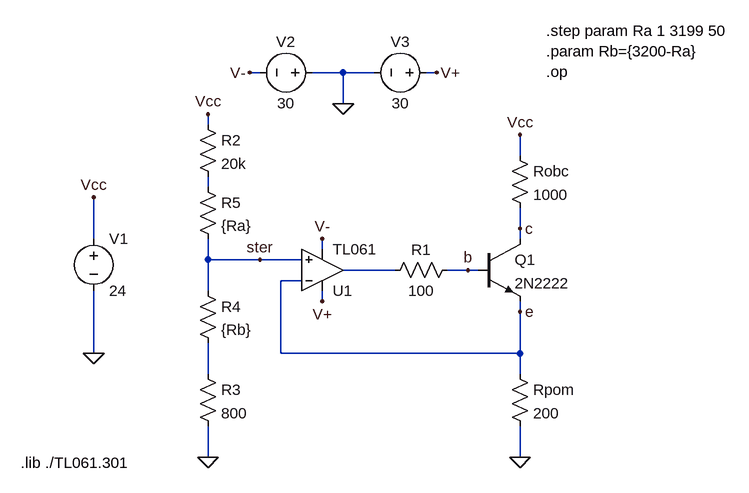
[diagram p0: schematic NPN.asc]
NPN.asc, the LTspice schematic file:
Version 4
SHEET 1 1228 680
WIRE 384 -272 368 -272
WIRE 512 -272 464 -272
WIRE 560 -272 512 -272
WIRE 656 -272 640 -272
WIRE 512 -224 512 -272
WIRE 304 -192 304 -208
WIRE 784 -144 784 -176
WIRE 304 -96 304 -112
WIRE 784 -32 784 -64
WIRE 128 -16 128 -80
WIRE 784 -16 784 -32
WIRE 480 0 480 -16
WIRE 304 16 304 -16
WIRE 384 16 304 16
WIRE 448 16 384 16
WIRE 592 32 512 32
WIRE 704 32 672 32
WIRE 720 32 704 32
WIRE 448 48 416 48
WIRE 304 64 304 16
WIRE 480 80 480 64
WIRE 784 96 784 80
WIRE 128 160 128 64
WIRE 416 160 416 48
WIRE 784 160 784 96
WIRE 784 160 416 160
WIRE 304 192 304 144
WIRE 784 192 784 160
WIRE 304 320 304 272
WIRE 784 320 784 272
FLAG 128 -80 Vcc
FLAG 128 160 0
FLAG 512 -224 0
FLAG 656 -272 V+
FLAG 368 -272 V-
FLAG 480 -16 V-
FLAG 480 80 V+
FLAG 784 -176 Vcc
FLAG 784 320 0
FLAG 784 96 e
FLAG 784 -32 c
FLAG 704 32 b
FLAG 304 320 0
FLAG 304 -208 Vcc
FLAG 384 16 ster
SYMBOL npn 720 -16 R0
SYMATTR InstName Q1
SYMATTR Value 2N2222
SYMBOL OpAmps\\opamp2 480 96 M180
SYMATTR InstName U1
SYMATTR Value TL061
SYMBOL voltage 128 -32 R0
WINDOW 123 0 0 Left 0
WINDOW 39 0 0 Left 0
SYMATTR InstName V1
SYMATTR Value 24
SYMBOL voltage 480 -272 R90
WINDOW 0 -32 56 VBottom 2
WINDOW 3 32 56 VTop 2
WINDOW 123 0 0 Left 0
WINDOW 39 0 0 Left 0
SYMATTR InstName V2
SYMATTR Value 30
SYMBOL voltage 656 -272 R90
WINDOW 0 -32 56 VBottom 2
WINDOW 3 32 56 VTop 2
WINDOW 123 0 0 Left 0
WINDOW 39 0 0 Left 0
SYMATTR InstName V3
SYMATTR Value 30
SYMBOL res 768 -160 R0
SYMATTR InstName Robc
SYMATTR Value 1000
SYMBOL res 768 176 R0
SYMATTR InstName Rpom
SYMATTR Value 200
SYMBOL res 688 16 R90
WINDOW 0 0 56 VBottom 2
WINDOW 3 32 56 VTop 2
SYMATTR InstName R1
SYMATTR Value 100
SYMBOL res 288 -208 R0
SYMATTR InstName R2
SYMATTR Value 20k
SYMBOL res 288 176 R0
SYMATTR InstName R3
SYMATTR Value 800
SYMBOL res 288 48 R0
SYMATTR InstName R4
SYMATTR Value {Rb}
SYMBOL res 288 -112 R0
SYMATTR InstName R5
SYMATTR Value {Ra}
TEXT 16 328 Left 2 !.lib ./TL061.301
TEXT 824 -336 Left 2 !.step param Ra 1 3199 50\n.param Rb={3200-Ra}\n.op

The netlist it stands for:
* NPN.asc
Q1 c b e 0 2N2222
XU1 ster e V+ V- N002 TL061  ; pins In+ In- V+ V- OUT
V1 Vcc 0 24
V2 0 V- 30
V3 V+ 0 30
Robc Vcc c 1000
Rpom e 0 200
R1 b N002 100
R2 Vcc N001 20k
R3 N003 0 800
R4 ster N003 {Rb}
R5 N001 ster {Ra}
.model NPN NPN
.model PNP PNP
.lib standard.bjt
.lib ./TL061.301
.step param Ra 1 3199 50
.param Rb={3200-Ra}
.op
.backanno
.end

* Results of the author's LTspice run, read from the files saved beside the schematic
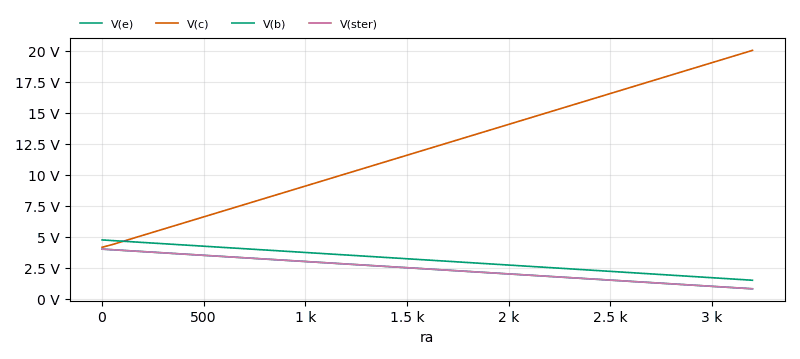
[diagram p1: Operating Point of NPN.asc, plotted from the saved traces]
* Operating Point, 1 run:
*   V(e): 3.998 V at ra=1 , 800.8 mV at ra=3.199 k, min 800.8 mV, max 3.998 V
*   V(c): 4.148 V at ra=1 , 20.01 V at ra=3.199 k, min 4.148 V, max 20.01 V
*   V(b): 4.738 V at ra=1 , 1.489 V at ra=3.199 k, min 1.489 V, max 4.738 V
*   V(ster): 3.999 V at ra=1 , 801 mV at ra=3.199 k, min 801 mV, max 3.999 V
* From the log:
*   Semiconductor Device Operating Points:
*                           --- Diodes ---
*   Name:    d:u1:p      d:u1:ln     d:u1:lp     d:u1:e      d:u1:c
*   Model:    u1:dx       u1:dx       u1:dx       u1:dx       u1:dx
*   Id:     -6.00e-11   -1.51e-11   -1.49e-11   -3.26e-11   -2.30e-11
*   Vd:     -6.00e+01   -1.51e+01   -1.49e+01   -3.26e+01   -2.30e+01
*   Req:     1.00e+12    1.00e+12    1.00e+12    1.00e+12    1.00e+12
*   CAP:     0.00e+00    0.00e+00    0.00e+00    0.00e+00    0.00e+00
*                           --- Bipolar Transistors ---
*   Name:       q1
*   Model:    2n2222
*   Ib:       1.39e-04
*   Ic:       1.99e-02
*   Vbe:      7.40e-01
*   Vbc:      5.90e-01
*   Vce:      1.50e-01
*   BetaDC:   1.43e+02
*   Gm:       7.23e-01
*   Rpi:      2.41e+02
*   Rx:       1.00e+01
*   Ro:       2.74e+02
*   Cbe:      3.33e-10
*   Cbc:      3.82e-10
*   Cjs:      0.00e+00
*   BetaAC:   1.74e+02
*   Cbx:      0.00e+00
*   Ft:       1.61e+08
*                           --- JFET Transistors ---
*   Name:    j:u1:2      j:u1:1
*   Model:    u1:jx       u1:jx
*   Id:     -2.57e-05   -2.58e-05
*   Vgs:     4.94e-01    4.93e-01
*   Vds:    -3.32e+01   -3.32e+01
*   Gm:      1.02e-04    1.02e-04
*   Gds:     0.00e+00    0.00e+00
*   Cgs:     0.00e+00    0.00e+00
*   Cgd:     0.00e+00    0.00e+00